# EasyEDA Pro project ProPrj_NavBot-EN01_2025-11-07.epro, board OLED
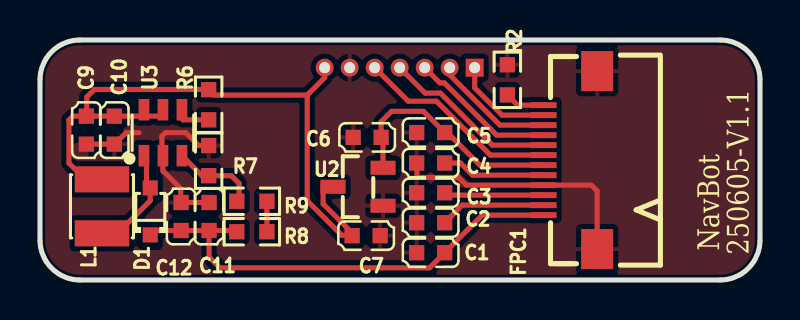
[diagram p12: board, top side]
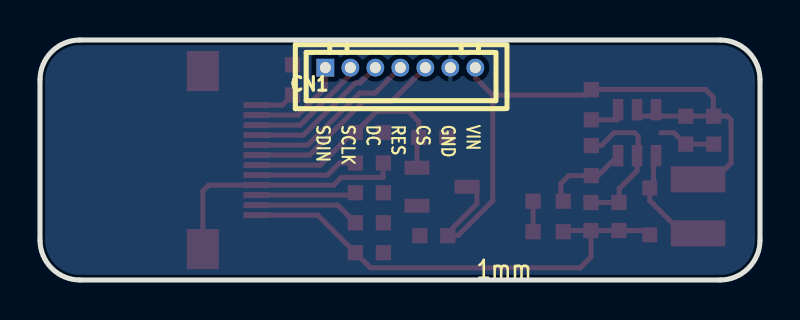
[diagram p13: board, bottom side, seen from below]

Outline 36 x 12 mm; copper layers: Top Layer, Bottom Layer. Coordinates in mm from the lower left corner of the outline.
Outline path: 0,10 0,2 arc(0.59,0.59) 2,0 34,0 arc(35.41,0.59) 36,2 36,10 arc(35.41,11.41) 34,12 2,12 arc(0.59,11.41) 0,10
Stack: Top Layer 0.035mm / Dielectric1 1.51mm FR4 er 4.5 / Bottom Layer 0.035mm

## Design rules (mm)
template: 自定义配置
spacing copperThickness1oz (default): track to track 0.127, other pairs 0.152 to 0.3
spacing copperThickness2oz: track to track 0.203, other pairs 0.152 to 0.3
track width copperThickness1oz (default): min 0.127, default 0.254, max 2.54
track width copperThickness2oz: min 0.203, default 0.254, max 2.54
differential pair differentialPair (default): width min 0.127, default 0.254, max 2.54; gap min 0.152, default 0.152
via viaSize (default): diameter min 0.5, default 0.61, max 10; hole min 0.3, default 0.305, max 6.3

## Placement (name value [footprint] x y rotation side)
C1  4.7uF  [C0603]  19.53 1.35 0 top
C2  4.7uF  [C0603]  19.53 2.84 0 top
C3  4.7uF  [C0603]  19.53 4.34 0 top
C4  1uF  [C0603]  19.53 5.87 180 top
C5  1uF  [C0603]  19.53 7.39 180 top
C6  10uF  [C0603]  16.36 7.11 0 top
C7  10uF  [C0603]  16.31 2.23 180 top
C9  10uF  [C0603]  2.34 7.49 90 top
C10  100nF  [C0603]  3.73 7.49 90 top
C11  10uF  [C0603]  8.43 3.17 270 top
C12  100nF  [C0603]  7.04 3.17 270 top
CN1  HC-1.25-7A  [CONN-TH_7P-P1.25_HCTL_HC-1.25-7A]  17.98 10.62 180 bottom
D1  1N4148WS  [SOD-323_L1.8-W1.3-LS2.5-RD]  5.51 3.43 90 top
FPC1  AFC01-S12FCA-00  [FPC-SMD_AFC01-S12FCA-00]  26.52 5.99 90 top
L1  22uH  [IND-SMD_L3.0-W3.0_FNR30XXS]  3.1 3.68 90 top
R2  620kΩ  [R0603]  23.37 10.01 270 top
R6  10kΩ  [R0603]  8.43 8.76 90 top
R7  10kΩ  [R0603]  8.43 5.97 270 top
R8  200kΩ  [R0603]  10.59 2.41 180 top
R9  6.8kΩ  [R0603]  10.59 3.94 0 top
U2  HT7533S  [SOT-23-3_L2.9-W1.5-P1.90-LS2.8-BR-CW]  15.9 4.66 0 top
U3  MT3608  [SOT-23-6_L2.9-W1.6-P0.95-LS2.8-BL]  6.15 7.37 0 top

## Footprints (pads in the part's own frame, mm; a bottom-side part is the same pattern mirrored in y, then rotated)
C0603
  rect 0.762x0.762 smd: 1(-0.7,0.019) 2(0.7,0.019)
CONN-TH_7P-P1.25_HCTL_HC-1.25-7A
  rect 0.889x0.889 hole 0.55x0.508: 1(-3.75,0)
  round 0.889 hole 0.55x0.508: 2(-2.5,0) 3(-1.25,0) 4(0,0) 5(1.25,0) 6(2.5,0) 7(3.75,0)
FPC-SMD_AFC01-S12FCA-00
  rect 0.3x1.3 smd: 1(-2.751,1.341) 2(-2.251,1.341) 3(-1.751,1.341) 4(-1.25,1.341) 5(-0.75,1.341) 6(-0.249,1.341) 7(0.251,1.341) 8(0.75,1.341) 9(1.249,1.341) 10(1.75,1.341) 11(2.249,1.341) 12(2.75,1.341)
  rect 2x1.6 smd: 13(-4.45,-1.34) 14(4.45,-1.341)
IND-SMD_L3.0-W3.0_FNR30XXS
  rect 1.3x2.72 smd: 1(1.35,0) 2(-1.35,0)
R0603
  rect 0.762x0.762 smd: 1(-0.753,0) 2(0.753,0)
SOD-323_L1.8-W1.3-LS2.5-RD
  rect 0.75x0.75 smd: 1(-1.173,0) 2(1.173,0)
SOT-23-3_L2.9-W1.5-P1.90-LS2.8-BR-CW
  rect 1.25x0.7 smd: 1(1.25,-0.95) 2(-1.25,0) 3(1.25,0.95)
SOT-23-6_L2.9-W1.6-P0.95-LS2.8-BL
  rect 0.532x1.072 smd: 1(-0.95,-1.149) 2(0,-1.149) 3(0.95,-1.149) 4(0.95,1.149) 5(0,1.149) 6(-0.95,1.149)

## Nets
As in the schematic.

## Routing (per net, layer and track width the routed paths; a pad name or vN(x,y) marks a point on that pad's centre or on a via; arc(x,y) is an arc through that point)
+3.3V: length 11.8
  Top Layer w0.254: U2.3 17.15,7.04 C6.2 17.06,7.91 17.58,8.43 19.17,8.43 C5.1 20.36,7.37 21.99,5.74 25.18,5.74
+13V: length 23.8
  Top Layer w0.254: R8.2 9.78,2.47 C11.2 ; C11.2 C12.2 5.73,2.47 D1.1 ; C11.2 8.45,1.15 8.99,0.61 19.48,0.61 22.11,3.24 25.18,3.24
GND: length 23.6
  Top Layer w0.254: 8.43,3.88 7.04,3.88 7.04,4.57 6.15,5.46 U3.2 6.09,6.27 6.09,7.19 6.27,7.37 7.29,7.37 7.93,6.72 R7.1 ; 2.34,6.79 3.73,6.79 4.31,7.37 4.95,7.37 ; FPC1.13 27.86,4.45 27.56,4.74 21.32,4.74 20.93,5.13 18.85,5.13 18.85,5.83 C4.2
VDD: length 5.2
  Top Layer w0.254: C4.1 21.03,5.85 21.63,5.24 25.18,5.24
VIN: length 35
  Top Layer w0.254: 2.34,8.19 1.64,8.19 1.45,8 1.45,5.84 2.26,5.03 L1.1 ; 2.34,8.19 6.15,8.19 U3.5 ; 2.34,8.19 2.34,9.14 2.72,9.53 8.42,9.53 R6.2 8.7,9.25 13.36,9.25 ; U2.2 14.52,4.8 14.16,4.8 14.16,3.8 15.61,2.35 15.61,2.23 15.09,2.23 13.36,3.96 13.36,9.25 ; 13.36,9.25 14.23,10.12 14.23,10.47
CS: length 10.3
  Top Layer w0.254: 25.18,6.25 22.52,6.25 19.82,8.94 18.41,8.94 16.73,10.62
DC: length 7.3
  Top Layer w0.254: 25.18,7.24 22.83,7.24 20.22,9.86 20,9.86 CN1.3
IREF: length 2
  Top Layer w0.254: R2.2 23.88,8.74 25.18,8.74
RES: length 8.8
  Top Layer w0.254: 25.18,6.74 22.62,6.74 20.01,9.35 19.25,9.35 CN1.4
SCLK: length 6.1
  Top Layer w0.254: CN1.2 20.48,10.26 23,7.74 25.18,7.74
SDIN: length 5
  Top Layer w0.254: 25.18,8.24 23.1,8.24 21.73,9.61 21.73,10.62
VCOMH: length 5.3
  Top Layer w0.254: 25.18,3.74 21.11,3.74 C2.2
VP: length 5
  Top Layer w0.254: 25.18,4.24 20.35,4.24 C3.2
$1N2453: length 1.8
  Top Layer w0.254: R6.1 7.15,8.01 7.1,8.07 U3.4
$1N2469: length 5.6
  Top Layer w0.254: U3.1 5.32,6.09 5.32,4.79 D1.2 5.51,3.97 3.75,2.21 3.23,2.21 3.1,2.33
$1N2861: length 1.5
  Top Layer w0.254: 11.34,2.41 11.34,3.94
$1N2983: length 4.4
  Top Layer w0.254: R9.1 9.96,4.06 9.96,4.83 9.57,5.22 R7.2 8.1,5.22 U3.3

## Copper pours and planes (outline as drawn; the poured copper is in the pictures)
GND on Top Layer: 0,12.24 35.05,12.24 36.32,10.97 36.32,1.19 35.05,-0.08 1.02,-0.08 0,0.94
GND on Bottom Layer: -0.25,12.45 36.32,12.45 36.32,-0.25 -0.25,-0.25

## Text on the board
Bottom Silkscreen Layer: VIN | GND | CS | RES | DC | SCLK | SDIN | 1mm
Top Silkscreen Layer: 250605-V1.1 | NavBot
